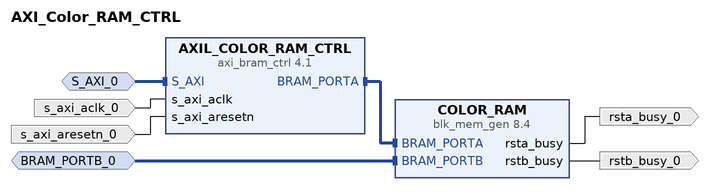
[diagram p0: block diagram of the top level]
# Vivado block design AXI_Color_RAM_CTRL, xc7z020clg400-1, Vivado 2023.2
create_bd_design AXI_Color_RAM_CTRL

create_bd_intf_port -mode Slave -vlnv xilinx.com:interface:bram_rtl:1.0 BRAM_PORTB_0
set_property -dict {CONFIG.MASTER_TYPE BRAM_CTRL} [get_bd_intf_ports BRAM_PORTB_0]
create_bd_intf_port -mode Slave -vlnv xilinx.com:interface:aximm_rtl:1.0 S_AXI_0
set_property -dict [list \
  CONFIG.ADDR_WIDTH 12 \
  CONFIG.ARUSER_WIDTH 0 \
  CONFIG.AWUSER_WIDTH 0 \
  CONFIG.BUSER_WIDTH 0 \
  CONFIG.CLK_DOMAIN AXI_Color_RAM_CTRL_s_axi_aclk_0 \
  CONFIG.DATA_WIDTH 32 \
  CONFIG.HAS_BRESP 1 \
  CONFIG.HAS_BURST 0 \
  CONFIG.HAS_CACHE 0 \
  CONFIG.HAS_LOCK 0 \
  CONFIG.HAS_PROT 1 \
  CONFIG.HAS_QOS 0 \
  CONFIG.HAS_REGION 0 \
  CONFIG.HAS_RRESP 1 \
  CONFIG.HAS_WSTRB 1 \
  CONFIG.ID_WIDTH 0 \
  CONFIG.MAX_BURST_LENGTH 1 \
  CONFIG.NUM_READ_OUTSTANDING 1 \
  CONFIG.NUM_READ_THREADS 1 \
  CONFIG.NUM_WRITE_OUTSTANDING 1 \
  CONFIG.NUM_WRITE_THREADS 1 \
  CONFIG.PROTOCOL AXI4LITE \
  CONFIG.READ_WRITE_MODE READ_WRITE \
  CONFIG.RUSER_BITS_PER_BYTE 0 \
  CONFIG.RUSER_WIDTH 0 \
  CONFIG.SUPPORTS_NARROW_BURST 0 \
  CONFIG.WUSER_BITS_PER_BYTE 0 \
  CONFIG.WUSER_WIDTH 0 \
] [get_bd_intf_ports S_AXI_0]
create_bd_port -dir I -type rst s_axi_aresetn_0
create_bd_port -dir O rsta_busy_0
create_bd_port -dir O rstb_busy_0
create_bd_port -dir I -type clk s_axi_aclk_0
set_property -dict {CONFIG.CLK_DOMAIN AXI_Color_RAM_CTRL_s_axi_aclk_0 CONFIG.FREQ_HZ 100000000} [get_bd_ports s_axi_aclk_0]

create_bd_cell -type ip -vlnv xilinx.com:ip:axi_bram_ctrl:4.1 AXIL_COLOR_RAM_CTRL
set_property -dict [list \
  CONFIG.PROTOCOL AXI4LITE \
  CONFIG.RD_CMD_OPTIMIZATION 0 \
  CONFIG.SINGLE_PORT_BRAM 1 \
] [get_bd_cells AXIL_COLOR_RAM_CTRL]
create_bd_cell -type ip -vlnv xilinx.com:ip:blk_mem_gen:8.4 COLOR_RAM
set_property -dict [list \
  CONFIG.Assume_Synchronous_Clk false \
  CONFIG.Enable_B Use_ENB_Pin \
  CONFIG.Memory_Type True_Dual_Port_RAM \
  CONFIG.Port_B_Clock 100 \
  CONFIG.Port_B_Enable_Rate 100 \
  CONFIG.Port_B_Write_Rate 50 \
  CONFIG.Use_RSTB_Pin true \
  CONFIG.use_bram_block BRAM_Controller \
] [get_bd_cells COLOR_RAM]

# ---- connections ----

connect_bd_intf_net [get_bd_intf_pins COLOR_RAM/BRAM_PORTA] [get_bd_intf_pins AXIL_COLOR_RAM_CTRL/BRAM_PORTA]
connect_bd_intf_net -intf_net BRAM_PORTB_0_1 [get_bd_intf_ports BRAM_PORTB_0] [get_bd_intf_pins COLOR_RAM/BRAM_PORTB]
connect_bd_intf_net -intf_net S_AXI_0_1 [get_bd_intf_pins AXIL_COLOR_RAM_CTRL/S_AXI] [get_bd_intf_ports S_AXI_0]
connect_bd_net [get_bd_pins COLOR_RAM/rsta_busy] [get_bd_ports rsta_busy_0]
connect_bd_net [get_bd_pins COLOR_RAM/rstb_busy] [get_bd_ports rstb_busy_0]
connect_bd_net -net s_axi_aclk_0_1 [get_bd_ports s_axi_aclk_0] [get_bd_pins AXIL_COLOR_RAM_CTRL/s_axi_aclk]
connect_bd_net -net s_axi_aresetn_0_1 [get_bd_ports s_axi_aresetn_0] [get_bd_pins AXIL_COLOR_RAM_CTRL/s_axi_aresetn]

# ---- address map ----
assign_bd_address -offset 0x000 -range 4K -target_address_space [get_bd_addr_spaces S_AXI_0] [get_bd_addr_segs AXIL_COLOR_RAM_CTRL/S_AXI/Mem0]

validate_bd_design
save_bd_design
